# Altium schematic sheet PowerDelivery.SchDoc
size A; SheetNumber: 2; SheetTotal: 2
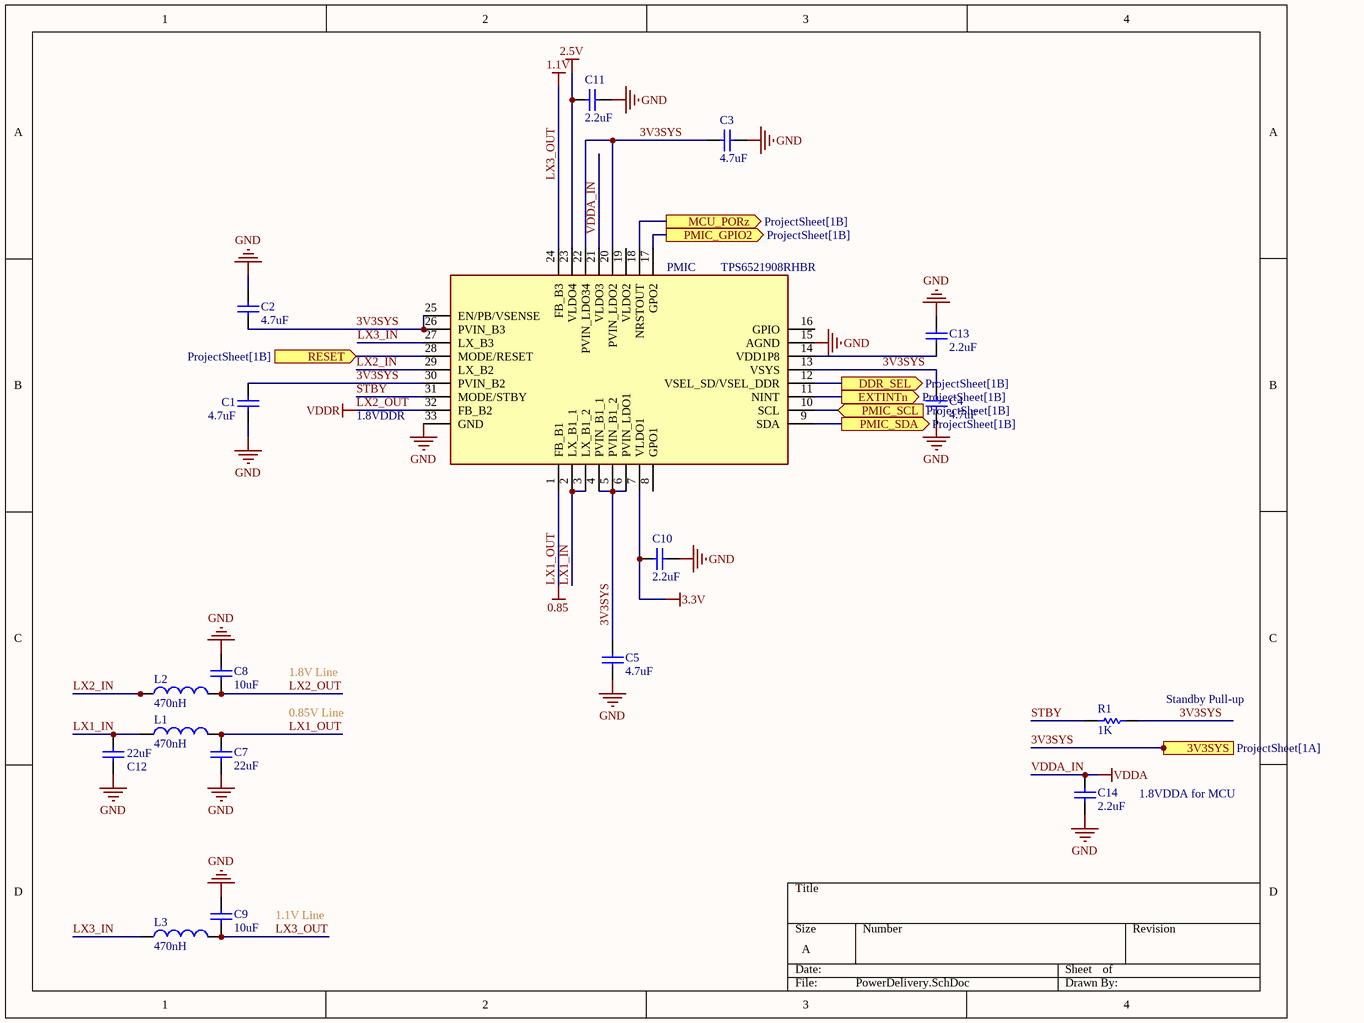
[diagram p0: PowerDelivery.SchDoc]

## Parts
C1  value 4.7uF  (hidden comment: Capacitor)
C2  value 4.7uF  (hidden comment: Capacitor)
C3  value 4.7uF  (hidden comment: Capacitor)
C4  value 4.7uF  (hidden comment: Capacitor)
C5  value 4.7uF  (hidden comment: Capacitor)
C7  value 22uF  (hidden comment: Capacitor)
C8  value 10uF  (hidden comment: Capacitor)
C9  value 10uF  (hidden comment: Capacitor)
C10  value 2.2uF  (hidden comment: Capacitor)
C11  value 2.2uF  (hidden comment: Capacitor)
C12  value 22uF  (hidden comment: Capacitor)
C13  value 2.2uF  (hidden comment: Capacitor)
C14  value 2.2uF  (hidden comment: Capacitor)
L1  value 470nH  (hidden comment: Inductor)
L2  value 470nH  (hidden comment: Inductor)
L3  value 470nH  (hidden comment: Inductor)
PMIC  TPS6521908RHBR  [QFN50P500X500X100-33N-D]
R1  value 1K  (hidden comment: Resistor)

## Ports
3V3SYS (in, see ProjectSheet[1A]), DDR_SEL (out, see ProjectSheet[1B]), EXTINTn (out, see ProjectSheet[1B]), MCU_PORz (out, see ProjectSheet[1B]), PMIC_GPIO2 (out, see ProjectSheet[1B]), PMIC_SCL (in, see ProjectSheet[1B]), PMIC_SDA (out, see ProjectSheet[1B]), RESET (in, see ProjectSheet[1B])

## Nets
2.5V: C11.1 PMIC.23(VLDO4)
3.3V: C10.2 PMIC.7(VLDO1)
GND: C1.1 C2.1 C3.2 C4.2 C5.1 C7.1 C8.1 C9.1 C10.1 C11.2 C12.1 C13.2 C14.1 PMIC.15(AGND) PMIC.33(GND)
LX1_OUT: C7.2 L1.2 PMIC.1(FB_B1)  [also labelled 0.85]
LX2_OUT: C8.2 L2.2 PMIC.32(FB_B2)  [also labelled VDDR]
LX3_OUT: C9.2 L3.2 PMIC.24(FB_B3)  [also labelled 1.1V]
VDDA_IN: C14.2 PMIC.21(VLDO3)  [also labelled VDDA]
3V3SYS: C1.2 C2.2 C3.1 C4.1 C5.2 PMIC.4(PVIN_B1_1) PMIC.5(PVIN_B1_2) PMIC.6(PVIN_LDO1) PMIC.13(VSYS) PMIC.20(PVIN_LDO2) PMIC.22(PVIN_LDO34) PMIC.25(EN/PB/VSENSE) PMIC.26(PVIN_B3) PMIC.30(PVIN_B2) R1.2 ; port 3V3SYS
DDR_SEL: PMIC.12(VSEL_SD/VSEL_DDR) ; port DDR_SEL
EXTINTn: PMIC.11(NINT) ; port EXTINTn
LX1_IN: C12.2 L1.1 PMIC.2(LX_B1_1) PMIC.3(LX_B1_2)
LX2_IN: L2.1 PMIC.29(LX_B2)
LX3_IN: L3.1 PMIC.27(LX_B3)
MCU_PORz: PMIC.18(NRSTOUT) ; port MCU_PORz
PMIC_GPIO2: PMIC.17(GPO2) ; port PMIC_GPIO2
PMIC_SCL: PMIC.10(SCL) ; port PMIC_SCL
PMIC_SDA: PMIC.9(SDA) ; port PMIC_SDA
RESET: PMIC.28(MODE/RESET) ; port RESET
STBY: PMIC.31(MODE/STBY) R1.1
NetC13_1: C13.1 PMIC.14(VDD1P8)

Not connected (* = marked no-connect by the designer): PMIC 8(GPO1) 16(GPIO) 19(VLDO2)

## Notes on the sheet
- (near PMIC) 1.8VDDR
- 1.8V Line
- (near R1) Standby Pull-up
- 0.85V Line
- 1.8VDDA for MCU
- 1.1V Line

## Library data of the parts
C1-C5 C7-C14 = Capacitor: SimulationGenericComponent: True
L1-L3 = Inductor: SimulationGenericComponent: True
PMIC = TPS6521908RHBR: Power Management Integrated Circuit; Manufacturer_Name: Texas Instruments; Datasheet Link: https://www.ti.com/product/TPS65219/part-details/TPS6521908RHBR?keyMatch=TPS6521908RHBR&tisearch=universal_search&usecase=OPN; Height: 1mm; Manufacturer_Part_Number: TPS6521908RHBR; Mouser Part Number: 595-TPS6521908RHBR; Mouser Price/Stock: https://www.mouser.co.uk/ProductDetail/Texas-Instruments/TPS6521908RHBR?qs=ST9lo4GX8V3r8g6AWJ0C8A%3D%3D; Supplier 1: DigiKey; Supplier Part Number 1: 296-TPS6521908RHBRCT-ND
R1 = Resistor: TC1: 0; SimulationGenericComponent: True; TC2: 0